# EAGLE design unoedge_v41 (EAGLE 7.3.0)
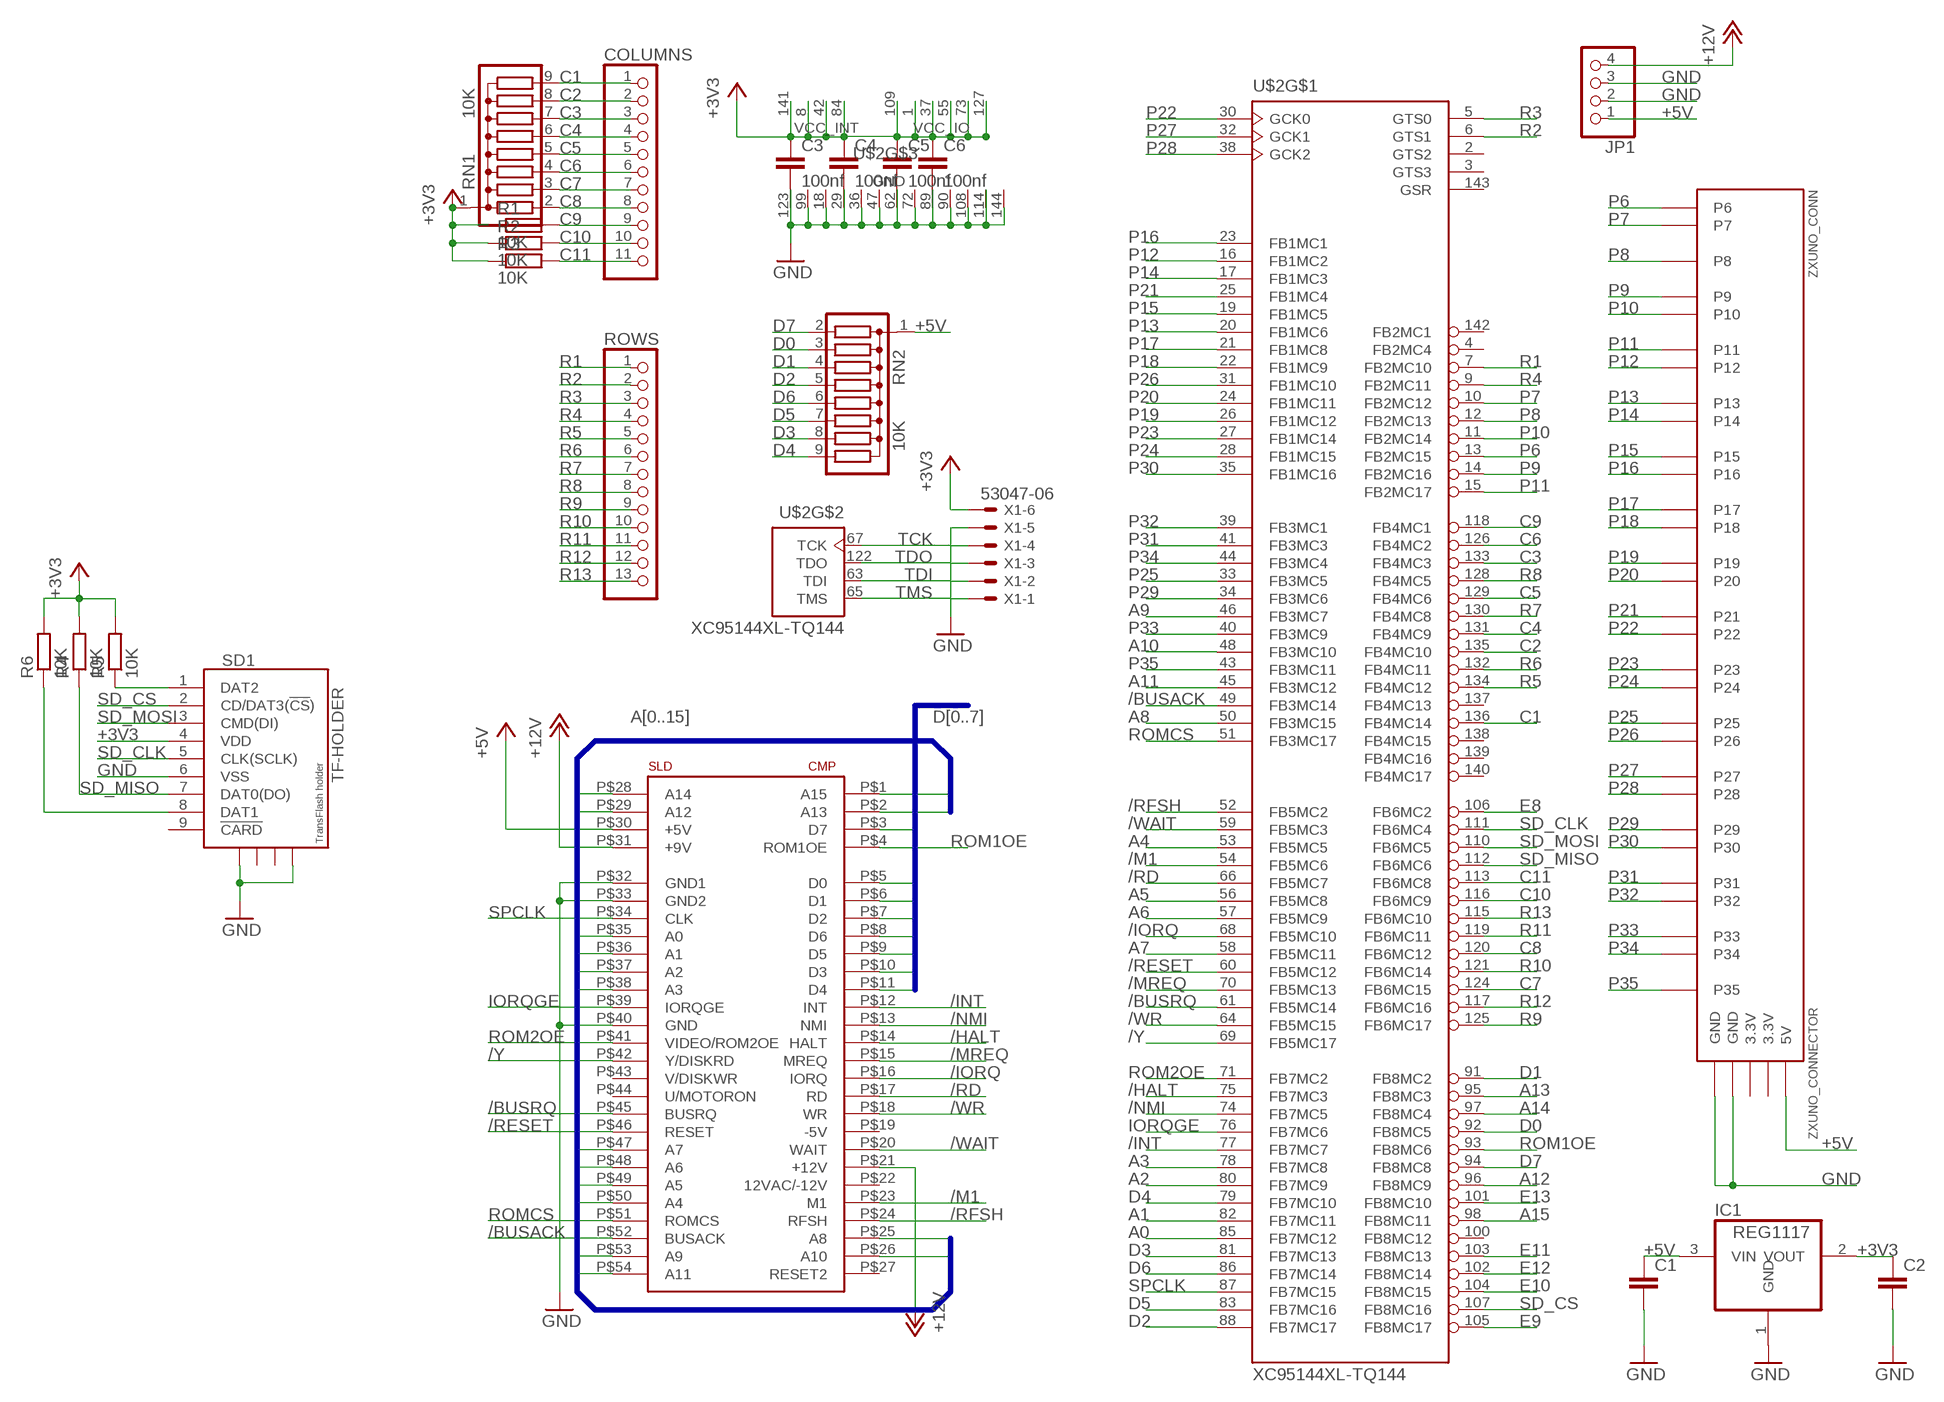
[diagram p0: schematic, sheet 1]

## Parts
C1  C-EUC0805  [C0805]
C2  C-EUC0805  [C0805]
C3  100nf  C-EUC0603  [C0603]
C4  100nf  C-EUC0603  [C0603]
C5  100nf  C-EUC0603  [C0603]
C6  100nf  C-EUC0603  [C0603]
COLUMNS  PINHD-1X11  [1X11]
IC1  REG1117  [SOT223]
JP1  PINHD-1X4  [1X04]
R1  10K  R-EU_R0603  [R0603]
R2  10K  R-EU_R0603  [R0603]
R3  10K  R-EU_R0603  [R0603]
R4  10K  R-EU_R0603  [R0603]
R5  10K  R-EU_R0603  [R0603]
R6  10K  R-EU_R0603  [R0603]
RN1  10K  G08R  [SIL9]
RN2  10K  G08R  [SIL9]
ROWS  PINHD-1X13  [1X13]
SD1  TF-HOLDER  [TF-PULL]
U$1  CONECTOR_EDGE_LADO_SPECTRUM  [CONECTOR_LADO_SPECTRUM]
U$2  XC95144XL-TQ144  [TQ144]
X1  53047-06  [53047-06]
ZXUNO_CONN  ZXUNO_CONNECTOR  [ZXUNO_CONNECTOR]

## Nets
+3V3 [power]: C2.1 C3.1 C4.1 C5.1 C6.1 IC1.2(VOUT) R1.1 R2.1 R3.1 R4.2 R5.2 R6.2 RN1.1 SD1.4(VDD) U$2.1(VCC_IO) U$2.8(VCC_INT) U$2.37(VCC_IO) U$2.42(VCC_INT) U$2.55(VCC_IO) U$2.73(VCC_IO) U$2.84(VCC_INT) U$2.109(VCC_IO) U$2.127(VCC_IO) U$2.141(VCC_INT) X1.1
+5V [power]: C1.1 IC1.3(VIN) JP1.1 RN2.1 U$1.P$30(+5V) ZXUNO_CONN.5V
+12V [power]: JP1.4 U$1.P$21(+12V) U$1.P$31(+9V)
/BUSACK: U$1.P$52(BUSACK) U$2.49(FB3MC14)
/BUSRQ: U$1.P$45(BUSRQ) U$2.61(FB5MC14)
/HALT [power]: U$1.P$14(HALT) U$2.75(FB7MC3)
/INT: U$1.P$12(INT) U$2.77(FB7MC7)
/IORQ: U$1.P$16(IORQ) U$2.68(FB5MC10)
/M1: U$1.P$23(M1) U$2.54(FB5MC6)
/MREQ: U$1.P$15(MREQ) U$2.70(FB5MC13)
/NMI: U$1.P$13(NMI) U$2.74(FB7MC5)
/RD: U$1.P$17(RD) U$2.66(FB5MC7)
/RESET: U$1.P$46(RESET) U$2.60(FB5MC12)
/RFSH [power]: U$1.P$24(RFSH) U$2.52(FB5MC2)
/WAIT: U$1.P$20(WAIT) U$2.59(FB5MC3)
/WR: U$1.P$18(WR) U$2.64(FB5MC15)
/Y: U$1.P$42(Y/DISKRD) U$2.69(FB5MC17)
A0: U$1.P$35(A0) U$2.85(FB7MC12)
A1: U$1.P$36(A1) U$2.82(FB7MC11)
A2: U$1.P$37(A2) U$2.80(FB7MC9)
A3: U$1.P$38(A3) U$2.78(FB7MC8)
A4: U$1.P$50(A4) U$2.53(FB5MC5)
A5: U$1.P$49(A5) U$2.56(FB5MC8)
A6: U$1.P$48(A6) U$2.57(FB5MC9)
A7: U$1.P$47(A7) U$2.58(FB5MC11)
A8: U$1.P$25(A8) U$2.50(FB3MC15)
A9: U$1.P$53(A9) U$2.46(FB3MC7)
A10: U$1.P$26(A10) U$2.48(FB3MC10)
A11: U$1.P$54(A11) U$2.45(FB3MC12)
A12: U$1.P$29(A12) U$2.96(FB8MC9)
A13: U$1.P$2(A13) U$2.95(FB8MC3)
A14: U$1.P$28(A14) U$2.97(FB8MC4)
A15: U$1.P$1(A15) U$2.98(FB8MC11)
C1: COLUMNS.1 RN1.9 U$2.136(FB4MC14)
C2: COLUMNS.2 RN1.8 U$2.135(FB4MC10)
C3: COLUMNS.3 RN1.7 U$2.133(FB4MC3)
C4: COLUMNS.4 RN1.6 U$2.131(FB4MC9)
C5: COLUMNS.5 RN1.5 U$2.129(FB4MC6)
C6: COLUMNS.6 RN1.4 U$2.126(FB4MC2)
C7: COLUMNS.7 RN1.3 U$2.124(FB6MC15)
C8: COLUMNS.8 RN1.2 U$2.120(FB6MC12)
C9: COLUMNS.9 R1.2 U$2.118(FB4MC1)
C10: COLUMNS.10 R2.2 U$2.116(FB6MC9)
C11: COLUMNS.11 R3.2 U$2.113(FB6MC8)
D0: RN2.3 U$1.P$5(D0) U$2.92(FB8MC5)
D1: RN2.4 U$1.P$6(D1) U$2.91(FB8MC2)
D2: RN2.5 U$1.P$7(D2) U$2.88(FB7MC17)
D3: RN2.8 U$1.P$10(D3) U$2.81(FB7MC13)
D4: RN2.9 U$1.P$11(D4) U$2.79(FB7MC10)
D5: RN2.7 U$1.P$9(D5) U$2.83(FB7MC16)
D6: RN2.6 U$1.P$8(D6) U$2.86(FB7MC14)
D7: RN2.2 U$1.P$3(D7) U$2.94(FB8MC8)
E8: U$2.106(FB6MC2)
E9: U$2.105(FB8MC17)
E10: U$2.104(FB8MC15)
E11: U$2.103(FB8MC13)
E12: U$2.102(FB8MC14)
E13: U$2.101(FB8MC10)
GND [power]: C1.2 C2.2 C3.2 C4.2 C5.2 C6.2 IC1.1(GND) JP1.2 JP1.3 SD1.6(VSS) SD1.S1 SD1.S4 U$1.P$32(GND1) U$1.P$33(GND2) U$1.P$40(GND) U$2.18(GND) U$2.29(GND) U$2.36(GND) U$2.47(GND) U$2.62(GND) U$2.72(GND) U$2.89(GND) U$2.90(GND) U$2.99(GND) U$2.108(GND) U$2.114(GND) U$2.123(GND) U$2.144(GND) X1.2 ZXUNO_CONN.GND@1(GND) ZXUNO_CONN.GND@2(GND)
IORQGE: U$1.P$39(IORQGE) U$2.76(FB7MC6)
N$2: R6.1 SD1.8(DAT1)
N$3: R5.1 SD1.1(DAT2)
P6: U$2.13(FB2MC15) ZXUNO_CONN.P6
P7: U$2.10(FB2MC12) ZXUNO_CONN.P7
P8: U$2.12(FB2MC13) ZXUNO_CONN.P8
P9: U$2.14(FB2MC16) ZXUNO_CONN.P9
P10: U$2.11(FB2MC14) ZXUNO_CONN.P10
P11: U$2.15(FB2MC17) ZXUNO_CONN.P11
P12: U$2.16(FB1MC2) ZXUNO_CONN.P12
P13: U$2.20(FB1MC6) ZXUNO_CONN.P13
P14: U$2.17(FB1MC3) ZXUNO_CONN.P14
P15: U$2.19(FB1MC5) ZXUNO_CONN.P15
P16: U$2.23(FB1MC1) ZXUNO_CONN.P16
P17: U$2.21(FB1MC8) ZXUNO_CONN.P17
P18: U$2.22(FB1MC9) ZXUNO_CONN.P18
P19: U$2.26(FB1MC12) ZXUNO_CONN.P19
P20: U$2.24(FB1MC11) ZXUNO_CONN.P20
P21: U$2.25(FB1MC4) ZXUNO_CONN.P21
P22: U$2.30(GCK0) ZXUNO_CONN.P22
P23: U$2.27(FB1MC14) ZXUNO_CONN.P23
P24: U$2.28(FB1MC15) ZXUNO_CONN.P24
P25: U$2.33(FB3MC5) ZXUNO_CONN.P25
P26: U$2.31(FB1MC10) ZXUNO_CONN.P26
P27: U$2.32(GCK1) ZXUNO_CONN.P27
P28: U$2.38(GCK2) ZXUNO_CONN.P28
P29: U$2.34(FB3MC6) ZXUNO_CONN.P29
P30: U$2.35(FB1MC16) ZXUNO_CONN.P30
P31: U$2.41(FB3MC3) ZXUNO_CONN.P31
P32: U$2.39(FB3MC1) ZXUNO_CONN.P32
P33: U$2.40(FB3MC9) ZXUNO_CONN.P33
P34: U$2.44(FB3MC4) ZXUNO_CONN.P34
P35: U$2.43(FB3MC11) ZXUNO_CONN.P35
R1: ROWS.1 U$2.7(FB2MC10)
R2: ROWS.2 U$2.6(GTS1)
R3: ROWS.3 U$2.5(GTS0)
R4: ROWS.4 U$2.9(FB2MC11)
R5: ROWS.5 U$2.134(FB4MC12)
R6: ROWS.6 U$2.132(FB4MC11)
R7: ROWS.7 U$2.130(FB4MC8)
R8: ROWS.8 U$2.128(FB4MC5)
R9: ROWS.9 U$2.125(FB6MC17)
R10: ROWS.10 U$2.121(FB6MC14)
R11: ROWS.11 U$2.119(FB6MC11)
R12: ROWS.12 U$2.117(FB6MC16)
R13: ROWS.13 U$2.115(FB6MC10)
ROM1OE: U$1.P$4(ROM1OE) U$2.93(FB8MC6)
ROM2OE: U$1.P$41(VIDEO/ROM2OE) U$2.71(FB7MC2)
ROMCS: U$1.P$51(ROMCS) U$2.51(FB3MC17)
SD_CLK: SD1.5(CLK(SCLK)) U$2.111(FB6MC4)
SD_CS: SD1.2(CD/DAT3(!CS!)) U$2.107(FB8MC16)
SD_MISO: R4.1 SD1.7(DAT0(DO)) U$2.112(FB6MC6)
SD_MOSI: SD1.3(CMD(DI)) U$2.110(FB6MC5)
SPCLK: U$1.P$34(CLK) U$2.87(FB7MC15)
TCK: U$2.67(TCK) X1.3
TDI: U$2.63(TDI) X1.5
TDO: U$2.122(TDO) X1.4
TMS: U$2.65(TMS) X1.6
Unconnected: SD1.9(!CARD) SD1.S2 SD1.S3 U$1.P$19(-5V) U$1.P$22(12VAC/-12V) U$1.P$27(RESET2) U$1.P$43(V/DISKWR) U$1.P$44(U/MOTORON) U$2.2(GTS2) U$2.3(GTS3) U$2.4(FB2MC4) U$2.100(FB8MC12) U$2.137(FB4MC13) U$2.138(FB4MC15) U$2.139(FB4MC16) U$2.140(FB4MC17) U$2.142(FB2MC1) U$2.143(GSR)

## Buses
D[0..7]
A[0..15]

## Power pins joined to a net without a drawn wire
3.3V: ZXUNO_CONN.3.3V@1(3.3V) ZXUNO_CONN.3.3V@2(3.3V)

## Library data of the parts
C1-C6 = rcl:C-EU: CAPACITOR, European symbol
COLUMNS = pinhead:PINHD-1X11: PIN HEADER
IC1 = burr-brown:REG1117: 800mA and 1A Low Dropout (LDO) Positive Regulator 1.8V, 2.5V, 2.85V, 3.3V, 5V, and Adj; MPN: REG1117; OC_FARNELL: 1097566; OC_NEWARK: 14P6981
JP1 = pinhead:PINHD-1X4: PIN HEADER
R1-R6 = rcl:R-EU_: RESISTOR, European symbol
RN1 RN2 = resistor-sil:G08R: SIL RESISTOR; OC_FARNELL: unknown; OC_NEWARK: unknown
ROWS = pinhead:PINHD-1X13: PIN HEADER
SD1 = sd-mmc:TF-HOLDER: TF / Micro SD socket is PUSH-PUSH type, the card can be pushed into and auto locked and pushed out by simply press the card. Surface Mounting type.
U$1 = zx_spectrum:CONECTOR_EDGE_LADO_SPECTRUM
U$2 = XC9500XLneu:XC95144XL-TQ144
X1 = con-molex:53?-06: CONNECTOR wire to board 1.25 mm (.049 inch) pitch header; MPN: 53047-0610-C; OC_FARNELL: 9733078; OC_NEWARK: 03M2965
ZXUNO_CONN = zxuno:ZXUNO_CONNECTOR

## Net classes
0 default: width 0.178 mm, clearance 0.178 mm
1 power: width 0.305 mm, clearance 0.178 mm to class 0, clearance 0.229 mm

## Board
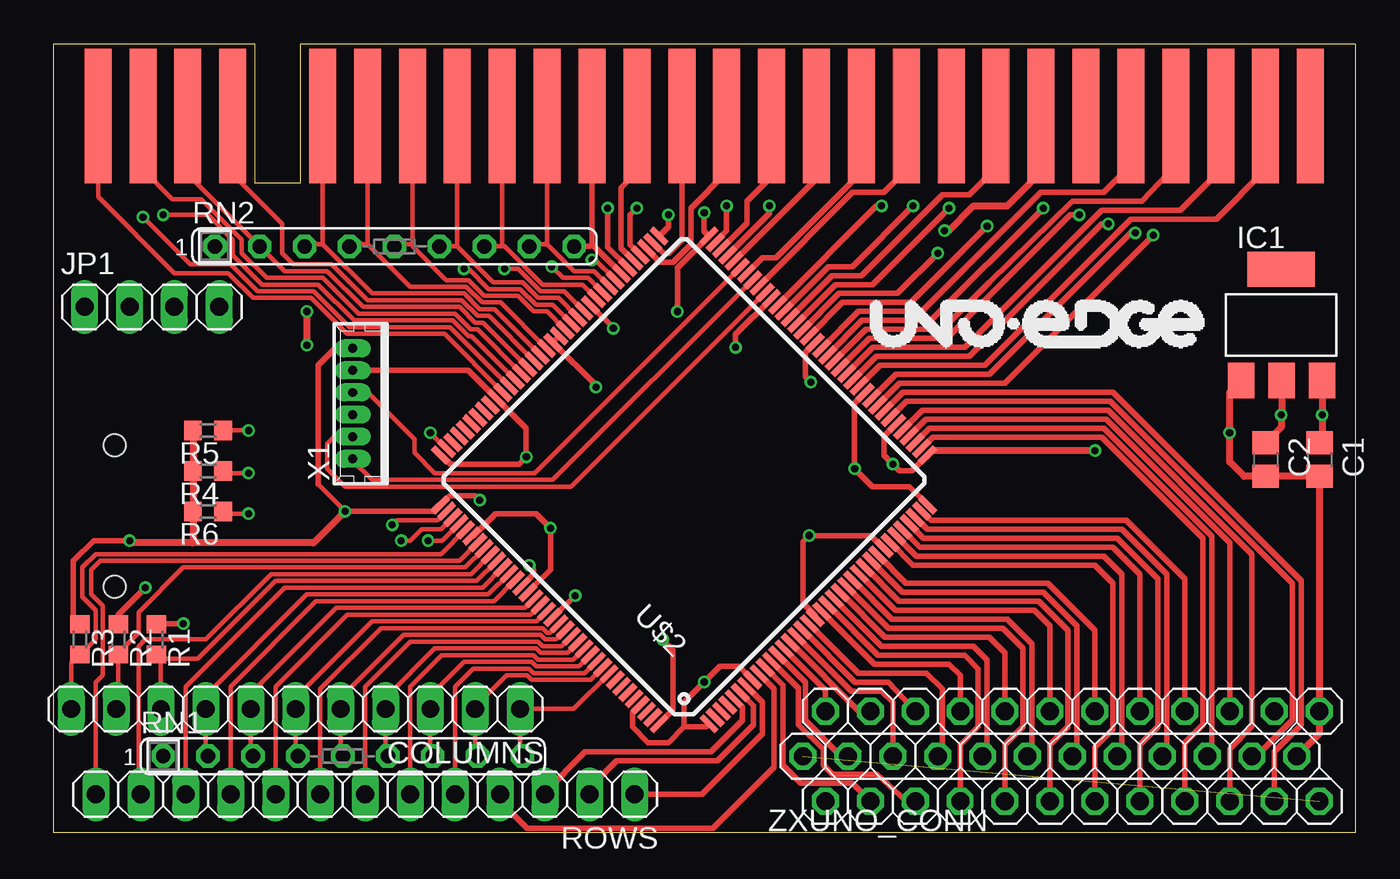
[diagram p1: board, top side]
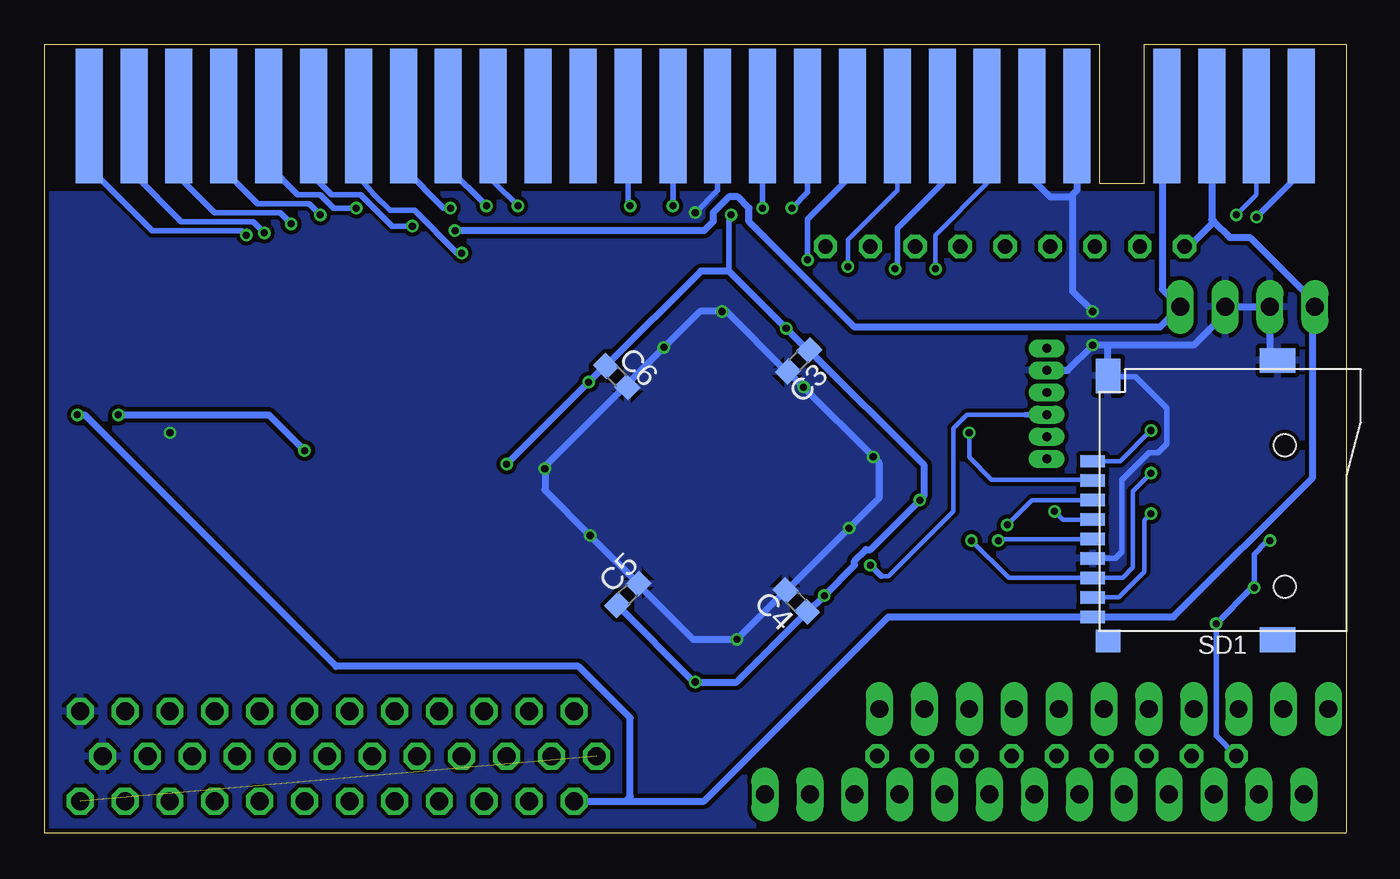
[diagram p2: board, bottom side, seen from below]

Size 73.66 x 44.58 mm. Coordinates in mm from the lower left corner, seen from the top.
Outline: 0,44.58 0,0.02
Outline: 73.66,44.58 73.66,0 0,0
Copper layers (1*16): Top 0.035mm / dielectric 1.5mm / Bottom 0.035mm
Design rules "dirt_cheap_dirty_boards.v1": minimum track width 5mil, minimum drill 12mil, track to track 5mil, track to pad 5mil, pad to pad 5mil, via to via 5mil, smd to smd 0mil, copper to edge 10mil, drill to drill 10mil, minimum pad ring 10mil, minimum via ring 6mil, stop-mask expansion 2mil, vias tented up to drill 25mil, thermal gap 10mil

### Footprints (pad centres in the part's own frame; a part is rotated, then mirrored left to right if it is on the bottom)
C0805 = smd 1.3 x 1.5: 1 -0.95,0; 2 0.95,0
C0603 = smd 1.1 x 1: 1 -0.85,0; 2 0.85,0
1X11 = drill 1.016 long: 1 -12.7,0; 2 -10.16,0; 3 -7.62,0; 4 -5.08,0; 5 -2.54,0; 6 0,0; 7 2.54,0; 8 5.08,0; 9 7.62,0; 10 10.16,0; 11 12.7,0
SOT223 = smd 1.499 x 2.007: 1 -2.261,-3.15; 2 0.025,-3.15; 3 2.311,-3.15 | smd 3.81 x 2.007: 4 0,3.15
1X04 = drill 1.016 long: 1 -3.81,0; 2 -1.27,0; 3 1.27,0; 4 3.81,0
R0603 = smd 1 x 1.1: 1 -0.85,0; 2 0.85,0
SIL9 = drill 0.813 octagon: 1 -10.16,0; 2 -7.62,0; 3 -5.08,0; 4 -2.54,0; 5 0,0; 6 2.54,0; 7 5.08,0; 8 7.62,0; 9 10.16,0
1X13 = drill 1.016 long: 1 -15.24,0; 2 -12.7,0; 3 -10.16,0; 4 -7.62,0; 5 -5.08,0; 6 -2.54,0; 7 0,0; 8 2.54,0; 9 5.08,0; 10 7.62,0; 11 10.16,0; 12 12.7,0; 13 15.24,0
TF-PULL = smd 0.7 x 1.4: 1 -2.2,-7.62; 2 -1.1,-7.62; 3 0,-7.62; 4 1.1,-7.62; 5 2.2,-7.62; 6 3.3,-7.62; 7 4.4,-7.62; 8 5.5,-7.62; 9 6.6,-7.62 | smd 1.4 x 2: S1 -7.9,2.85; S2 7.9,2.85 | smd 1.28 x 1.4: S3 7.96,-6.75 | smd 1.95 x 1.4: S4 -7.025,-6.75 | hole 1.25: -3.1,3.25; 4.9,3.25
CONECTOR_LADO_SPECTRUM = smd 7.62 x 1.524: P$1 2.54,2.54; P$2 2.54,0; P$3 2.54,-2.54; P$4 2.54,-5.08; P$5 2.54,-10.16; P$6 2.54,-12.7; P$7 2.54,-15.24; P$8 2.54,-17.78; P$9 2.54,-20.32; P$10 2.54,-22.86; P$11 2.54,-25.4; P$12 2.54,-27.94; P$13 2.54,-30.48; P$14 2.54,-33.02; P$15 2.54,-35.56; P$16 2.54,-38.1; P$17 2.54,-40.64; P$18 2.54,-43.18; P$19 2.54,-45.72; P$20 2.54,-48.26; P$21 2.54,-50.8; P$22 2.54,-53.34; P$23 2.54,-55.88; P$24 2.54,-58.42; P$25 2.54,-60.96; P$26 2.54,-63.5; P$27 2.54,-66.04 | smd 7.62 x 1.524 bottom: P$28 2.54,2.54; P$29 2.54,0; P$30 2.54,-2.54; P$31 2.54,-5.08; P$32 2.54,-10.16; P$33 2.54,-12.7; P$34 2.54,-15.24; P$35 2.54,-17.78; P$36 2.54,-20.32; P$37 2.54,-22.86; P$38 2.54,-25.4; P$39 2.54,-27.94; P$40 2.54,-30.48; P$41 2.54,-33.02; P$42 2.54,-35.56; P$43 2.54,-38.1; P$44 2.54,-40.64; P$45 2.54,-43.18; P$46 2.54,-45.72; P$47 2.54,-48.26; P$48 2.54,-50.8; P$49 2.54,-53.34; P$50 2.54,-55.88; P$51 2.54,-58.42; P$52 2.54,-60.96; P$53 2.54,-63.5; P$54 2.54,-66.04
TQ144 = smd 1.2 x 0.35: 1 -10.75,8.75; 2 -10.75,8.25; 3 -10.75,7.75; 4 -10.75,7.25; 5 -10.75,6.75; 6 -10.75,6.25; 7 -10.75,5.75; 8 -10.75,5.25; 9 -10.75,4.75; 10 -10.75,4.25; 11 -10.75,3.75; 12 -10.75,3.25; 13 -10.75,2.75; 14 -10.75,2.25; 15 -10.75,1.75; 16 -10.75,1.25; 17 -10.75,0.75; 18 -10.75,0.25; 19 -10.75,-0.25; 20 -10.75,-0.75; 21 -10.75,-1.25; 22 -10.75,-1.75; 23 -10.75,-2.25; 24 -10.75,-2.75; 25 -10.75,-3.25; 26 -10.75,-3.75; 27 -10.75,-4.25; 28 -10.75,-4.75; 29 -10.75,-5.25; 30 -10.75,-5.75; 31 -10.75,-6.25; 32 -10.75,-6.75; 33 -10.75,-7.25; 34 -10.75,-7.75; 35 -10.75,-8.25; 36 -10.75,-8.75; 73 10.75,-8.75; 74 10.75,-8.25; 75 10.75,-7.75; 76 10.75,-7.25; 77 10.75,-6.75; 78 10.75,-6.25; 79 10.75,-5.75; 80 10.75,-5.25; 81 10.75,-4.75; 82 10.75,-4.25; 83 10.75,-3.75; 84 10.75,-3.25; 85 10.75,-2.75; 86 10.75,-2.25; 87 10.75,-1.75; 88 10.75,-1.25; 89 10.75,-0.75; 90 10.75,-0.25; 91 10.75,0.25; 92 10.75,0.75; 93 10.75,1.25; 94 10.75,1.75; 95 10.75,2.25; 96 10.75,2.75; 97 10.75,3.25; 98 10.75,3.75; 99 10.75,4.25; 100 10.75,4.75; 101 10.75,5.25; 102 10.75,5.75; 103 10.75,6.25; 104 10.75,6.75; 105 10.75,7.25; 106 10.75,7.75; 107 10.75,8.25; 108 10.75,8.75 | smd 0.35 x 1.2: 37 -8.75,-10.75; 38 -8.25,-10.75; 39 -7.75,-10.75; 40 -7.25,-10.75; 41 -6.75,-10.75; 42 -6.25,-10.75; 43 -5.75,-10.75; 44 -5.25,-10.75; 45 -4.75,-10.75; 46 -4.25,-10.75; 47 -3.75,-10.75; 48 -3.25,-10.75; 49 -2.75,-10.75; 50 -2.25,-10.75; 51 -1.75,-10.75; 52 -1.25,-10.75; 53 -0.75,-10.75; 54 -0.25,-10.75; 55 0.25,-10.75; 56 0.75,-10.75; 57 1.25,-10.75; 58 1.75,-10.75; 59 2.25,-10.75; 60 2.75,-10.75; 61 3.25,-10.75; 62 3.75,-10.75; 63 4.25,-10.75; 64 4.75,-10.75; 65 5.25,-10.75; 66 5.75,-10.75; 67 6.25,-10.75; 68 6.75,-10.75; 69 7.25,-10.75; 70 7.75,-10.75; 71 8.25,-10.75; 72 8.75,-10.75; 109 8.75,10.75; 110 8.25,10.75; 111 7.75,10.75; 112 7.25,10.75; 113 6.75,10.75; 114 6.25,10.75; 115 5.75,10.75; 116 5.25,10.75; 117 4.75,10.75; 118 4.25,10.75; 119 3.75,10.75; 120 3.25,10.75; 121 2.75,10.75; 122 2.25,10.75; 123 1.75,10.75; 124 1.25,10.75; 125 0.75,10.75; 126 0.25,10.75; 127 -0.25,10.75; 128 -0.75,10.75; 129 -1.25,10.75; 130 -1.75,10.75; 131 -2.25,10.75; 132 -2.75,10.75; 133 -3.25,10.75; 134 -3.75,10.75; 135 -4.25,10.75; 136 -4.75,10.75; 137 -5.25,10.75; 138 -5.75,10.75; 139 -6.25,10.75; 140 -6.75,10.75; 141 -7.25,10.75; 142 -7.75,10.75; 143 -8.25,10.75; 144 -8.75,10.75
53047-06 = drill 0.5 pad 0.698 long: 1 3.125,0.45; 2 1.875,0.45; 3 0.625,0.45; 4 -0.625,0.45; 5 -1.875,0.45; 6 -3.125,0.45
ZXUNO_CONNECTOR = drill 1.016 octagon: 3.3V@1 -13.97,0; 3.3V@2 15.24,-2.54; 5V -12.7,-2.54; GND@1 15.24,2.54; GND@2 13.97,0; NC@1 12.7,2.54; P6 -12.7,2.54; P7 -10.16,-2.54; P8 -11.43,0; P9 -10.16,2.54; P10 -7.62,-2.54; P11 -8.89,0; P12 -7.62,2.54; P13 -5.08,-2.54; P14 -6.35,0; P15 -5.08,2.54; P16 -2.54,-2.54; P17 -3.81,0; P18 -2.54,2.54; P19 0,-2.54; P20 -1.27,0; P21 0,2.54; P22 2.54,-2.54; P23 1.27,0; P24 2.54,2.54; P25 5.08,-2.54; P26 3.81,0; P27 5.08,2.54; P28 7.62,-2.54; P29 6.35,0; P30 7.62,2.54; P31 10.16,-2.54; P32 8.89,0; P33 10.16,2.54; P34 12.7,-2.54; P35 11.43,0

### Placement (x,y rotation side)
C1  71.63,21.08 270 top
C2  68.58,21.08 270 top
C3  30.99,26.67 225 bottom
C4  31.11,13.08 135 bottom
C5  40.64,13.46 45 bottom
C6  41.27,25.78 315 bottom
COLUMNS  13.72,6.99 180 top
IC1  69.47,28.7 0 top
JP1  5.59,29.72 0 top
R1  5.84,10.92 270 top
R2  3.68,10.92 270 top
R3  1.52,10.92 270 top
R4  8.76,20.45 180 top
R5  8.76,22.73 180 top
R6  8.76,18.16 180 top
RN1  16.38,4.32 0 top
RN2  19.3,33.15 0 top
ROWS  17.65,2.16 180 top
SD1  6.73,18.8 270 bottom
U$1  5.08,37.97 90 top
U$2  35.69,19.94 135 top
X1  17.4,24.26 90 top
ZXUNO_CONN  56.39,4.32 0 top

### Tracks (layer width: path | path; a pad name or v marks a point on that pad's centre or on a via)
3.3V  (1 unrouted)
+3V3  (via drill 0.4)
  Top 0.254: 14.99,19.68 v16.51,18.16
  Top 0.305: 30.38,29.81 U$2.84 31.69,28.54 v31.69,28.51 | v34.8,34.92 34.8,34.25 U$2.73 | v42.86,25.46 42.55,25.78 42.55,27.15 U$2.55 | 49.48,21.28 U$2.37 48.57,20.45 47.88,20.45 v47.5,20.83 46.99,21.34 46.99,22.4 U$2.42 | U$2.8 38.8,9.4 37.72,9.4 v36.83,8.51 35.69,7.37 35.69,5.97 | 35.69,5.97 34.8,5.08 33.66,5.08 32.77,5.97 32.77,6.76 U$2.141 | 35.69,5.97 36.92,5.97 U$2.1 | U$2.127 28.29,12.16 v29.53,13.4 | v24.13,18.8 23.88,19.05 22.42,19.05 U$2.109 21.83,18.52 21.46,18.16 v16.51,18.16 | 14.99,19.68 14.99,26.42 16.13,27.56 16.9,27.56 X1.1 | v7.37,11.81 5.88,11.81 R1.1 | R3.1 1.14,12.15 1.14,15.37 2.29,16.51 v4.32,16.51 | v5.21,13.84 3.68,12.32 R2.1 3.6,11.77 3.56,11.81
  Top 0.406: v16.51,18.16 14.73,16.38 7.87,16.38 | R5.2 R4.2 R6.2 7.91,16.42 7.87,16.38 | 7.87,16.38 4.45,16.38 v4.32,16.51 | C2.1 69.49,22.95 69.49,23.6 v69.47,23.62 69.49,23.65 IC1.2 | v58.93,21.59 49.71,21.59 U$2.37
  Bottom 0.254: SD1.4 16.05,17.7 v16.51,18.16
  Bottom 0.305: 34.92,31.75 34.92,34.8 v34.8,34.92 | RN1.1 7.37,5.46 v7.37,11.81 5.33,13.84 v5.21,13.84 5.21,15.75 4.57,16.38 v4.32,16.51
  Bottom 0.406: v47.5,20.83 v42.86,25.46 41.94,26.38 C6.1 36.51,31.75 34.92,31.75 v31.69,28.51 30.45,27.27 C3.1 23.88,20.76 23.88,19.05 v24.13,18.8 26.92,16 27.18,16 27.81,15.37 27.81,15.11 v29.53,13.4 30.45,12.48 C4.1 34.48,8.51 v36.83,8.51 36.89,8.51 C5.1 | v69.47,23.62 60.96,23.62 v58.93,21.59
+5V  (via drill 0.4)
  Top 0.406: IC1.3 v71.78,23.62 71.78,22.18 C1.1
  Bottom 0.406: U$1.P$30 7.62,34.67 7.49,34.54 | 7.49,34.54 6.6,33.66 5.46,33.66 1.78,29.97 JP1.1 1.91,29.59 1.91,20.07 9.78,12.19 25.91,12.19 36.32,1.78 40.77,1.78 | v71.78,23.62 71.37,23.62 57.15,9.4 43.43,9.4 40.51,6.48 40.51,2.03 40.77,1.78 | ZXUNO_CONN.5V 40.77,1.78 | RN2.1 8.89,33.15 7.49,34.54
+12V  (via drill 0.4)
  Top 0.406: 55.88,37.08 U$1.P$21 55.88,37.34 53.98,35.43 52.07,35.43 50.67,34.04 v50.42,34.04
  Bottom 0.406: v50.42,34.04 36.32,34.04 35.81,34.54 35.81,35.05 34.92,35.94 34.42,35.94 33.78,35.31 33.78,34.54 27.81,28.57 10.54,28.57 JP1.4 10.41,30.73 10.41,36.83 10.16,37.08 U$1.P$31
/BUSACK  (via drill 0.4)
  Top 0.305: v59.69,34.42 59.31,34.42 51.82,26.92 46.56,26.92 U$2.49
  Bottom 0.305: U$1.P$52 66.04,37.08 64.01,35.05 60.33,35.05 v59.69,34.42
/BUSRQ  (via drill 0.4)
  Top 0.305: v46.86,35.43 46.59,35.43 U$2.61
  Bottom 0.305: U$1.P$45 48.26,36.83 v46.86,35.43
/HALT
  Top 0.305: U$1.P$14 38.1,37.34 36.07,35.31 36.07,33.27 35.05,32.26 34.33,32.26 U$2.75
/INT
  Top 0.305: U$1.P$12 33.02,37.34 32.13,36.45 32.13,33.04 U$2.77
/IORQ
  Top 0.305: U$1.P$16 43.18,36.98 U$2.68
/M1
  Top 0.305: U$1.P$23 60.96,37.72 59.44,36.2 55.88,36.2 49.15,29.46 45.56,29.46 U$2.54
/MREQ
  Top 0.305: U$1.P$15 40.64,37.08 39.24,35.69 39.24,34.45 U$2.70
/NMI
  Top 0.305: U$1.P$13 35.56,33.53 34.8,32.77 34.53,32.77 U$2.74
/RD
  Top 0.305: U$1.P$17 45.72,37.34 40.89,32.51 40.13,32.51 U$2.66
/RESET  (via drill 0.4)
  Top 0.305: v48.64,35.43 45.21,32 43.86,32 U$2.60
  Bottom 0.305: U$1.P$46 50.8,37.59 v48.64,35.43
/RFSH
  Top 0.305: U$1.P$24 63.5,37.72 61.59,35.69 57.66,35.69 52.96,31.11 50.29,28.45 45.96,28.45 U$2.52
/WAIT
  Top 0.305: U$1.P$20 53.34,37.59 51.82,36.07 50.29,36.07 45.72,31.5 44.06,31.5 U$2.59
/WR
  Top 0.305: U$1.P$18 48.26,37.47 46.99,36.2 45.23,36.2 U$2.64
/Y  (via drill 0.4)
  Top 0.305: v40.51,35.43 40.51,35.02 U$2.69
  Bottom 0.305: U$1.P$42 40.64,35.69 v40.51,35.43
A0  (via drill 0.4)
  Top 0.254: v25.53,31.88 26.29,31.88 27.56,30.61 28.91,30.61 U$2.85
  Bottom 0.305: U$1.P$35 22.86,36.7 25.4,34.16 25.4,32 v25.53,31.88
A1  (via drill 0.4)
  Top 0.254: v28.19,32 28.83,31.37 30.27,31.37 U$2.82
  Bottom 0.254: U$1.P$36 25.4,36.32 28.19,33.53 v28.19,32
A2  (via drill 0.4)
  Top 0.254: v30.48,32.38 30.66,32.38 U$2.80
  Bottom 0.305: U$1.P$37 27.94,37.21 30.48,34.67 v30.48,32.38
A3  (via drill 0.4)
  Top 0.305: v31.37,35.31 31.37,33.1 U$2.78
  Bottom 0.305: U$1.P$38 30.48,36.2 v31.37,35.31
A4  (via drill 0.4)
  Top 0.305: v56.01,35.31 49.66,28.96 45.77,28.96 U$2.53
  Bottom 0.305: U$1.P$50 60.96,37.72 59.31,36.07 58.04,36.07 57.28,35.31 v56.01,35.31
A5  (via drill 0.4)
  Top 0.305: U$2.56 44.66,29.97 48.51,29.97 v52.83,34.29
  Bottom 0.305: U$1.P$49 58.42,37.08 57.4,36.07 55.75,36.07 53.98,34.29 v52.83,34.29
A6  (via drill 0.4)
  Top 0.305: U$2.57 44.46,30.48 47.75,30.48 v50.04,32.77
  Bottom 0.305: U$1.P$48 55.88,37.08 54.99,36.07 54.1,35.18 52.7,35.18 50.29,32.77 v50.04,32.77
A7  (via drill 0.4)
  Top 0.305: v50.67,35.31 46.35,30.99 44.26,30.99 U$2.58
  Bottom 0.305: U$1.P$47 53.34,37.59 51.05,35.31 v50.67,35.31
A8
  Top 0.305: U$1.P$25 66.04,37.47 63.75,35.18 59.31,35.18 51.56,27.43 46.36,27.43 U$2.50
A9  (via drill 0.4)
  Top 0.305: v61.21,33.91 60.96,33.91 52.96,25.91 47.67,25.91 U$2.46
  Bottom 0.305: U$1.P$53 68.58,37.21 65.91,34.54 61.85,34.54 v61.21,33.91
A10
  Top 0.305: U$1.P$26 68.58,37.47 65.79,34.67 60.96,34.67 52.7,26.42 46.76,26.42 U$2.48
A11  (via drill 0.4)
  Top 0.305: v62.23,33.78 53.85,25.4 47.87,25.4 U$2.45
  Bottom 0.305: U$1.P$54 71.12,37.59 67.56,34.04 62.48,34.04 v62.23,33.78
A12  (via drill 0.4)
  Top 0.254: v6.22,34.92 8.76,34.92 10.16,33.53 10.16,32.64 11.81,30.99 14.99,30.99 17.02,28.96 22.61,28.96 23.5,28.07 23.67,28.07 U$2.96
  Bottom 0.254: U$1.P$29 5.08,36.07 v6.22,34.92
A13
  Top 0.254: U$1.P$2 5.08,37.47 6.73,35.81 8.38,35.81 10.67,33.53 10.67,32.77 12.06,31.37 15.24,31.37 17.27,29.34 22.73,29.34 23.62,28.45 24,28.45 U$2.95
A14  (via drill 0.4)
  Top 0.254: v5.08,34.8 7.75,32.13 10.03,32.13 11.56,30.61 14.73,30.61 16.76,28.57 22.45,28.57 U$2.97
  Bottom 0.305: U$1.P$28 2.54,37.34 v5.08,34.8
A15
  Top 0.254: U$1.P$1 2.54,35.94 6.86,31.62 9.91,31.62 11.3,30.23 14.61,30.23 16.64,28.19 22.13,28.19 U$2.98
C1
  Top 0.254: U$2.136 29.45,6.99 COLUMNS.1 26.42,4.45 RN1.9
C2
  Top 0.254: U$2.135 30.39,8.64 27.05,8.64 26.8,8.89 25.65,8.89 24,7.24 COLUMNS.2 23.88,4.45 RN1.8
C3
  Top 0.254: U$2.133 29.74,9.4 27.3,9.4 27.05,9.65 23.24,9.65 21.46,7.87 COLUMNS.3 21.34,4.45 RN1.7
C4
  Top 0.254: U$2.131 29.09,10.16 27.56,10.16 27.3,10.41 21.59,10.41 18.92,7.75 COLUMNS.4 18.8,4.45 RN1.6
C5
  Top 0.254: U$2.129 28.44,10.92 27.81,10.92 27.56,11.18 19.81,11.18 16.38,7.75 COLUMNS.5 16.26,4.45 RN1.5
C6
  Top 0.254: U$2.126 27.33,11.94 18.03,11.94 13.72,7.62 COLUMNS.6 13.72,4.45 RN1.4
C7
  Top 0.254: U$2.124 26.68,12.7 16,12.7 11.18,7.87 COLUMNS.7 11.18,4.45 RN1.3
C8
  Top 0.254: U$2.120 24.61,13.46 14.35,13.46 8.64,7.75 COLUMNS.8 8.64,4.45 RN1.2
C9
  Top 0.254: COLUMNS.9 6.1,9.82 | 6.1,9.82 R1.2 | 6.1,9.82 8.17,9.82 12.57,14.22 23.96,14.22 U$2.118
C10
  Top 0.254: U$2.116 23.31,14.99 7.37,14.99 4.83,12.45 4.83,11.3 3.72,10.2 R2.2 3.68,7.11 COLUMNS.10
C11
  Top 0.254: COLUMNS.11 1.02,9.56 R3.2 1.56,10.07 2.41,10.92 2.41,12.57 1.65,13.34 1.65,14.99 2.41,15.75 11.56,15.75 11.94,15.75 21.95,15.75 U$2.113
D0
  Top 0.254: U$1.P$5 15.24,33.27 | 15.24,33.27 18.03,30.48 23.24,30.48 24.13,29.59 24.97,29.59 U$2.92 | RN2.3 14.35,33.27 15.24,33.27
D1
  Top 0.254: U$1.P$6 17.78,33.27 | 17.78,33.27 20.19,30.86 23.37,30.86 24.26,29.97 25.3,29.97 U$2.91 | RN2.4 16.89,33.27 17.78,33.27
D2
  Top 0.254: U$1.P$7 20.32,33.27 | 20.32,33.27 20.32,33.15 22.23,31.24 23.5,31.24 24.38,30.35 26.29,30.35 27.18,29.46 27.93,29.46 U$2.88 | RN2.5 19.43,33.27 20.32,33.27
D3
  Top 0.254: U$1.P$10 27.94,33.27 | 27.94,33.27 29.46,31.75 30.59,31.75 U$2.81 | RN2.8 27.05,33.27 27.94,33.27
D4
  Top 0.305: 30.48,33.28 U$2.79 | RN2.9 30.35,33.15 30.48,33.28 | 30.48,33.28 U$1.P$11
D5
  Top 0.254: 25.53,33.15 27.69,30.99 29.94,30.99 U$2.83 | RN2.7 25.53,33.15 | U$1.P$9 25.4,33.27 25.53,33.15
D6
  Top 0.254: U$1.P$8 22.86,33.15 | 22.86,33.15 24.89,31.11 26.54,31.11 27.43,30.23 28.58,30.23 U$2.86 | RN2.6 22.86,33.15
D7
  Top 0.254: U$1.P$3 7.62,37.21 RN2.2 13.08,31.75 15.49,31.75 17.53,29.72 22.99,29.72 23.88,28.83 24.32,28.83 U$2.94
GND  (via drill 0.4)
  Top 0.305: v34.48,10.92 34.48,10.86 35.05,10.29 35.05,6.93 U$2.144 | U$2.123 28.13,14.86 v28.13,17.21 27.3,18.03 25.02,18.03 23.74,16.76 U$2.114 | 21.9,21.41 U$2.108 21.95,21.35 22.48,20.83 26.35,20.83 v26.76,21.24 26.76,22.85 U$2.99 23.48,26.13 X1.2 | U$2.29 46.26,16.79 v42.77,16.79 42.42,16.44 42.42,12.95 43.11,12.26 U$2.18 | U$2.47 45.34,24.29 v45.34,20.57 46.35,19.56 48.44,19.56 U$2.36 | v38.61,27.43 38.61,28.16 U$2.62 | v36.83,35.05 36.83,34 U$2.72 35.31,31.93 v35.31,29.46 | v30.7,25.18 30.7,25.28 U$2.90 U$2.89
  Top 0.406: ZXUNO_CONN.GND@2 71.63,5.59 ZXUNO_CONN.GND@1 C1.2 C2.2 67.37,20.13 66.55,20.95 v66.55,22.61 66.55,24.89 IC1.1 | v14.35,29.46 v14.35,27.56
  Bottom 0.305: U$1.P$40 35.56,36.32 v36.83,35.05 | SD1.6 13.08,15.5 12.7,15.88 12.7,19.94 11.18,21.46 10.67,21.46 10.16,21.97 10.16,24 11.94,25.78 13.44,25.78 SD1.S4
  Bottom 0.406: C6.2 40.86,25.18 45.34,20.7 v45.34,20.57 45.34,19.36 v42.77,16.79 C5.2 40.04,14 36.96,10.92 v34.48,10.92 C4.2 31.66,13.68 v28.13,17.21 26.42,18.92 26.42,20.9 v26.76,21.24 v30.7,25.18 C3.2 31.66,26.07 35.05,29.46 v35.31,29.46 36.58,29.46 v38.61,27.43 40.64,25.4 | U$1.P$33 17.78,36.96 16.76,35.94 15.62,35.94 | 13.59,27.56 8.64,27.56 6.86,29.34 JP1.3 JP1.2 4.32,27.13 SD1.S1 | 13.59,27.56 v14.35,27.56 15.78,26.13 X1.2 | SD1.S4 13.48,27.45 13.59,27.56 | 15.62,35.94 15.49,35.94 15.49,30.61 v14.35,29.46 | U$1.P$32 15.24,36.32 15.62,35.94
  pour Bottom: 0.38,36.07 73.28,36.07 73.28,0.38 0.38,0.38
IORQGE  (via drill 0.4)
  Top 0.305: v33.02,35.31 32.64,34.92 32.64,33.24 U$2.76
  Bottom 0.305: U$1.P$39 v33.02,35.31
N$2  (via drill 0.4)
  Top 0.254: v11.05,18.03 9.74,18.03 R6.1
  Bottom 0.254: SD1.8 12.87,13.3 11.43,14.73 11.43,17.65 v11.05,18.03
N$3  (via drill 0.4)
  Top 0.254: v11.05,22.73 R5.1
  Bottom 0.254: SD1.1 12.79,21 v11.05,22.73
P6
  Top 0.305: ZXUNO_CONN.P6 43.69,8.05 U$2.13
P7
  Top 0.305: ZXUNO_CONN.P7 45.21,2.79 42.29,2.79 41.27,3.81 41.27,8.34 U$2.10
P8
  Top 0.305: ZXUNO_CONN.P8 44.58,4.32 42.55,6.35 42.55,8.48 U$2.12
P9
  Top 0.305: ZXUNO_CONN.P9 45.59,6.86 U$2.14
P10
  Top 0.305: ZXUNO_CONN.P10 48.26,1.78 46.61,3.3 44.07,3.3 43.56,3.81 43.56,4.7 42.16,6.1 42.16,8.16 U$2.11
P11
  Top 0.305: ZXUNO_CONN.P11 47.5,7.37 46.86,8 45.15,8 U$2.15
P12
  Top 0.305: ZXUNO_CONN.P12 47.24,8.51 45.35,8.51 U$2.16
P13
  Top 0.305: ZXUNO_CONN.P13 51.31,4.95 52.32,5.97 52.32,9.27 51.56,10.03 46.65,10.03 U$2.20
P14
  Top 0.305: ZXUNO_CONN.P14 50.29,4.57 50.29,8.13 49.4,9.02 45.55,9.02 U$2.17
P15
  Top 0.305: ZXUNO_CONN.P15 51.31,8.89 50.67,9.53 46.45,9.53 U$2.19
P16
  Top 0.305: ZXUNO_CONN.P16 53.85,4.95 54.86,5.97 54.86,10.41 53.72,11.56 47.25,11.56 U$2.23
P17
  Top 0.305: ZXUNO_CONN.P17 52.83,4.57 52.83,9.78 52.07,10.54 46.85,10.54 U$2.21
P18
  Top 0.305: ZXUNO_CONN.P18 53.85,10.16 52.96,11.05 47.05,11.05 U$2.22
P19
  Top 0.305: ZXUNO_CONN.P19 56.39,4.95 57.4,5.97 57.4,11.43 55.75,13.08 47.85,13.08 U$2.26
P20
  Top 0.305: ZXUNO_CONN.P20 55.37,4.57 55.37,10.67 53.98,12.06 47.45,12.06 U$2.24
P21
  Top 0.305: ZXUNO_CONN.P21 56.39,11.68 55.5,12.57 47.65,12.57 U$2.25
P22
  Top 0.305: ZXUNO_CONN.P22 58.93,4.83 59.94,5.84 59.94,14.1 58.93,15.11 48.65,15.11 U$2.30
P23
  Top 0.305: ZXUNO_CONN.P23 57.91,4.57 57.91,11.68 56.01,13.59 48.05,13.59 U$2.27
P24
  Top 0.305: ZXUNO_CONN.P24 58.93,11.43 56.26,14.1 48.25,14.1 U$2.28
P25
  Top 0.305: ZXUNO_CONN.P25 61.47,4.95 62.48,5.97 62.48,14.35 60.2,16.64 49.24,16.64 U$2.33
P26
  Top 0.305: ZXUNO_CONN.P26 60.45,4.57 60.45,14.61 59.44,15.62 48.84,15.62 U$2.31
P27
  Top 0.305: ZXUNO_CONN.P27 61.47,14.61 59.94,16.13 49.04,16.13 U$2.32
P28
  Top 0.305: ZXUNO_CONN.P28 64.01,5.08 65.02,6.1 65.02,16.64 59.31,22.35 49.77,22.35 U$2.38
P29
  Top 0.305: ZXUNO_CONN.P29 62.99,4.57 62.99,14.61 60.45,17.14 49.44,17.14 U$2.34
P30
  Top 0.305: ZXUNO_CONN.P30 64.01,14.35 60.71,17.65 49.64,17.65 U$2.35
P31
  Top 0.305: ZXUNO_CONN.P31 66.55,4.7 67.82,5.97 67.82,15.75 59.69,23.88 49.17,23.88 U$2.41
P32
  Top 0.305: ZXUNO_CONN.P32 65.53,4.57 65.53,16.76 59.44,22.86 49.57,22.86 U$2.39
P33
  Top 0.305: ZXUNO_CONN.P33 66.55,16.38 59.56,23.37 49.37,23.37 U$2.40
P34
  Top 0.305: ZXUNO_CONN.P34 69.09,4.57 70.61,6.1 70.61,14.22 59.94,24.89 48.06,24.89 U$2.44
P35
  Top 0.305: ZXUNO_CONN.P35 68.07,4.32 70.1,6.35 70.1,14.1 59.82,24.38 48.26,24.38 U$2.43
R1
  Top 0.305: ROWS.1 36.7,2.16 40.13,5.59 40.13,7.36 U$2.7
R2
  Top 0.305: ROWS.2 30.35,2.54 31.88,4.06 37.59,4.06 39.62,6.1 39.62,7.16 U$2.6
R3
  Top 0.305: ROWS.3 27.81,2.29 30.1,4.57 37.21,4.57 38.99,6.35 38.99,7.09 U$2.5
R4
  Top 0.305: U$2.9 40.77,8.14 40.77,3.68 37.34,0.25 26.8,0.25 25.27,1.78 ROWS.4
R5
  Top 0.254: ROWS.5 22.73,8.26 23.75,9.27 26.92,9.27 27.18,9.02 30.07,9.02 U$2.134
R6
  Top 0.254: ROWS.6 20.19,8.26 21.97,10.03 27.18,10.03 27.43,9.78 29.42,9.78 U$2.132
R7
  Top 0.254: ROWS.7 17.65,8.26 20.19,10.79 27.43,10.79 27.69,10.54 28.76,10.54 U$2.130
R8
  Top 0.254: ROWS.8 15.11,8.13 18.54,11.56 27.69,11.56 27.94,11.3 28.11,11.3 U$2.128
R9
  Top 0.254: ROWS.9 12.57,8.26 16.64,12.32 27.01,12.32 U$2.125
R10
  Top 0.254: ROWS.10 10.03,8.26 14.86,13.08 24.94,13.08 U$2.121
R11
  Top 0.254: ROWS.11 7.49,8.26 13.08,13.84 24.29,13.84 U$2.119
R12
  Top 0.254: U$2.117 23.64,14.61 12.32,14.61 8.64,10.92 5.21,10.92 4.83,10.54 4.83,2.29 ROWS.12
R13
  Top 0.254: ROWS.13 2.41,8.51 2.79,8.89 2.79,12.83 2.16,13.46 2.16,14.86 2.67,15.37 22.98,15.37 U$2.115
ROM1OE
  Top 0.254: U$1.P$4 10.16,37.21 12.95,34.42 12.95,32.77 13.59,32.13 15.75,32.13 17.78,30.1 23.11,30.1 24,29.21 24.65,29.21 U$2.93
ROM2OE  (via drill 0.4)
  Top 0.305: v38.1,35.43 38.1,34.02 U$2.71
  Bottom 0.305: U$1.P$41 v38.1,35.43
ROMCS  (via drill 0.4)
  Top 0.305: v58.04,34.92 57.53,34.92 50.55,27.94 46.16,27.94 U$2.51
  Bottom 0.305: U$1.P$51 63.5,37.47 61.59,35.56 58.67,35.56 v58.04,34.92
SD_CLK  (via drill 0.4)
  Top 0.254: v19.68,16.51 20.19,16.51 20.83,17.14 21.93,17.14 U$2.111
  Bottom 0.254: SD1.5 19.6,16.6 v19.68,16.51
SD_CS  (via drill 0.4)
  Top 0.254: U$2.107 22.23,21.71 v21.34,22.61
  Bottom 0.254: v21.34,22.61 21.34,21.21 20.07,19.94 14.39,19.94 SD1.2
SD_MISO  (via drill 0.4)
  Top 0.254: v11.05,20.32 9.74,20.32 R4.1 | v21.21,16.51 22,16.51 U$2.112
  Bottom 0.254: v11.05,20.32 12.06,19.3 12.06,14.99 12.65,14.4 SD1.7 19.09,14.4 v21.21,16.51
SD_MOSI  (via drill 0.4)
  Top 0.254: U$2.110 21.73,17.65 19.43,17.65 v19.18,17.4
  Bottom 0.254: SD1.3 17.78,18.8 v19.18,17.4
SPCLK  (via drill 0.4)
  Top 0.254: v23.24,31.88 23.5,31.88 24.64,30.73 26.42,30.73 27.3,29.84 28.26,29.84 U$2.87
  Bottom 0.254: U$1.P$34 20.32,36.7 23.24,33.78 v23.24,31.88
TCK
  Top 0.254: U$2.67 27.23,20.32 21.59,20.32 20.45,21.46 20.45,22.23 17.79,24.88 X1.3
TDI
  Top 0.254: X1.5 15.9,22.38 15.49,21.97 15.49,20.57 16.51,19.56 29.3,19.56 U$2.63
TDO  (via drill 0.4)
  Top 0.305: v26.92,15.11 27.18,14.86 27.18,14.61 U$2.122
  Bottom 0.254: 26.29,14.48 25.91,14.48 22.23,18.16 22.23,22.86 21.46,23.62 18.16,23.62
  Bottom 0.305: 26.29,14.48 v26.92,15.11 | 18.16,23.62 X1.4
TMS
  Top 0.254: X1.6 16.95,21.02 18.03,19.94 28.26,19.94 U$2.65